# EAGLE design sensors (EAGLE 6.1)
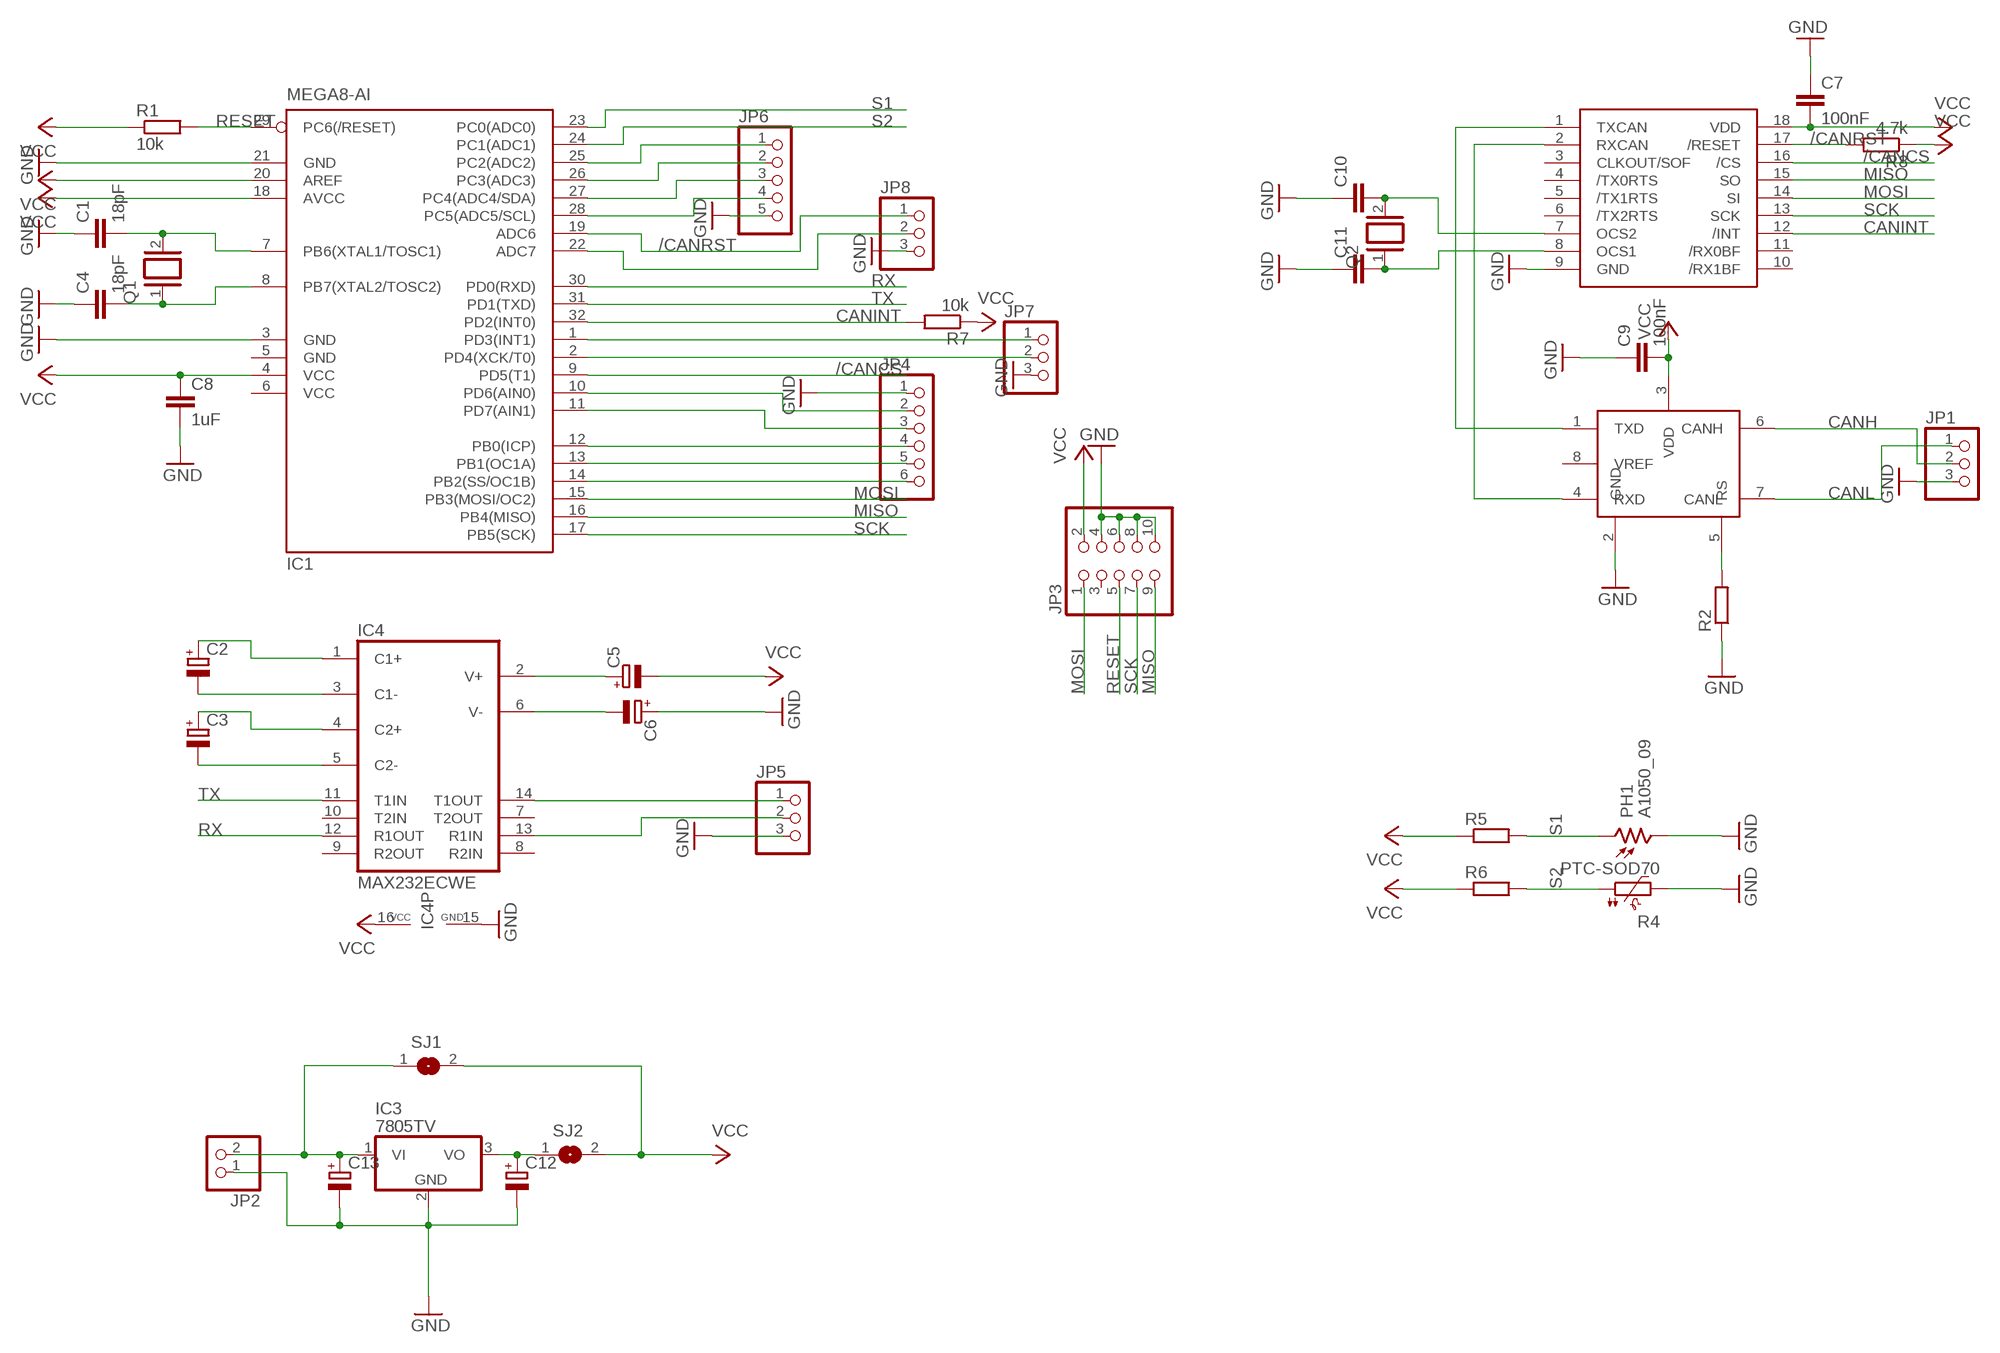
[diagram p0: schematic, sheet 1]

## Parts
C1  18pF  C-EUC0805  [C0805]
C2  CPOL-EUE3.5-8  [E3,5-8]
C3  CPOL-EUE3.5-8  [E3,5-8]
C4  18pF  C-EUC0805  [C0805]
C5  CPOL-EUE3.5-8  [E3,5-8]
C6  CPOL-EUE3.5-8  [E3,5-8]
C7  100nF  C-EUC0603  [C0603]
C8  1uF  C-EUC0603  [C0603]
C9  100nF  C-EUC0603  [C0603]
C10  C-EUC0805  [C0805]
C11  C-EUC0805  [C0805]
C12  CPOL-EU140CLH-0810  [140CLH-0810]
C13  CPOL-EU140CLH-0810  [140CLH-0810]
IC1  MEGA8-AI  [TQFP32-08]
IC3  7805TV  [TO220V]
IC4  MAX232ECWE  [SO16L]
JP1  PINHD-1X3  [1X03]
JP2  PINHD-1X2  [1X02]
JP3  PINHD-2X5  [2X05]
JP4  PINHD-1X6  [1X06]
JP5  PINHD-1X3  [1X03]
JP6  PINHD-1X5  [1X05]
JP7  PINHD-1X3  [1X03]
JP8  PINHD-1X3  [1X03]
PH1  A1050_09  [T0-46-A10XX]
Q1  XTAL/S  [QS]
Q2  XTAL/S  [QS]
R1  10k  R-EU_R0805  [R0805]
R2  R-EU_R0805  [R0805]
R4  PTC-SOD70  [SOD70]
R5  R-EU_R0805  [R0805]
R6  R-EU_R0805  [R0805]
R7  10k  R-EU_R0805  [R0805]
R8  4.7k  R-EU_R0805  [R0805]
SJ1  SJ  [SJ]
SJ2  SJ  [SJ]
U$1  MCP251518-LEAD_SOIC  [SOIC18L]
U$2  MCP2551SOIC8  [SOIC8]

## Nets
/CANCS: IC1.9(PD5(T1)) U$1.16(/CS)
/CANRST: IC1.19(ADC6) JP8.1 R8.2 U$1.17(/RESET)
CANH: JP1.2 U$2.6(CANH)
CANINT: IC1.32(PD2(INT0)) R7.2 U$1.12(/INT)
CANL: JP1.1 U$2.7(CANL)
GND: C1.1 C4.1 C6.+ C7.1 C8.2 C9.1 C10.1 C11.1 C12.- C13.- IC1.3(GND) IC1.21(GND) IC3.2(GND) IC4.15(GND) JP1.3 JP2.1 JP3.4 JP3.6 JP3.8 JP3.10 JP4.1 JP5.3 JP6.5 JP7.3 JP8.3 PH1.2 R2.1 R4.2 U$1.9(GND) U$2.2(GND)
MISO: IC1.16(PB4(MISO)) JP3.9 U$1.15(SO)
MOSI: IC1.15(PB3(MOSI/OC2)) JP3.1 U$1.14(SI)
N$1: U$1.1(TXCAN) U$2.1(TXD)
N$2: U$1.2(RXCAN) U$2.4(RXD)
N$3: C3.+ IC4.4(C2+)
N$4: C2.- IC4.3(C1-)
N$5: C2.+ IC4.1(C1+)
N$6: C3.- IC4.5(C2-)
N$7: C1.2 IC1.7(PB6(XTAL1/TOSC1)) Q1.2
N$8: C4.2 IC1.8(PB7(XTAL2/TOSC2)) Q1.1
N$9: R2.2 U$2.5(RS)
N$10: IC4.14(T1OUT) JP5.1
N$11: IC4.13(R1IN) JP5.2
N$12: C5.+ IC4.2(V+)
N$13: C6.- IC4.6(V-)
N$14: IC1.12(PB0(ICP)) JP4.4
N$15: C12.+ IC3.3(VO) SJ2.1
N$16: C13.+ IC3.1(VI) JP2.2 SJ1.1
N$17: IC1.13(PB1(OC1A)) JP4.5
N$18: IC1.14(PB2(SS/OC1B)) JP4.6
N$19: IC1.10(PD6(AIN0)) JP4.2
N$20: IC1.11(PD7(AIN1)) JP4.3
N$22: IC1.28(PC5(ADC5/SCL)) JP6.4
N$23: C10.2 Q2.2 U$1.7(OCS2)
N$24: IC1.27(PC4(ADC4/SDA)) JP6.3
N$25: IC1.26(PC3(ADC3)) JP6.2
N$26: IC1.25(PC2(ADC2)) JP6.1
N$27: IC1.1(PD3(INT1)) JP7.1
N$28: IC1.2(PD4(XCK/T0)) JP7.2
N$30: IC1.22(ADC7) JP8.2
N$31: C11.2 Q2.1 U$1.8(OCS1)
RESET: IC1.29(PC6(/RESET)) JP3.5 R1.2
RX: IC1.30(PD0(RXD)) IC4.12(R1OUT)
S1: IC1.23(PC0(ADC0)) PH1.1 R5.2
S2: IC1.24(PC1(ADC1)) R4.1 R6.2
SCK: IC1.17(PB5(SCK)) JP3.7 U$1.13(SCK)
TX: IC1.31(PD1(TXD)) IC4.11(T1IN)
VCC: C5.- C7.2 C8.1 C9.2 IC1.4(VCC) IC1.18(AVCC) IC1.20(AREF) IC4.16(VCC) JP3.2 R1.1 R5.1 R6.1 R7.1 R8.1 SJ1.2 SJ2.2 U$1.18(VDD) U$2.3(VDD)
Unconnected: IC4.7(T2OUT) IC4.8(R2IN) IC4.9(R2OUT) IC4.10(T2IN) JP3.3 U$1.3(CLKOUT/SOF) U$1.4(/TX0RTS) U$1.5(/TX1RTS) U$1.6(/TX2RTS) U$1.10(/RX1BF) U$1.11(/RX0BF) U$2.8(VREF)

## Power pins joined to a net without a drawn wire
GND: IC1.5(GND)
VCC: IC1.6(VCC)

## Library data of the parts
C1 C4 = resistor:C-EU: CAPACITOR, European symbol
C2 C3 C5 C6 = rcl:CPOL-EU: POLARIZED CAPACITOR, European symbol
C7-C11 = rcl:C-EU: CAPACITOR, European symbol
C12 C13 = resistor:CPOL-EU: POLARIZED CAPACITOR, European symbol
IC1 = atmel:MEGA8: MICROCONTROLLER 8 Kbytes FLASH, 1 kbytes SRAM, 512 bytes EEPROM, USART, 6-channel 10 bit ADC, 2-channel 8 bit ADC Pin compatible with Atmega48, ATMega88, ATMega168 Source: avr.lbr; MPN: ATMEGA8-16AU; OC_FARNELL: 9171371; OC_NEWARK: 73M8863
IC3 = linear:78*: Positive VOLTAGE REGULATOR Source: http://cache.national.com/ds/LM/LM78L05.pdf http://www.fairchildsemi.com/ds/LM/LM7805.pdf
IC4 = maxim:MAX232ECWE: RS232 TRANSEIVER; MF: MAXIM; MPN: MAX232ECWE+; OC_FARNELL: 9724435; OC_NEWARK: 67K4440
JP1 JP5 JP7 JP8 = pinhead:PINHD-1X3: PIN HEADER
JP2 = pinhead:PINHD-1X2: PIN HEADER
JP3 = pinhead:PINHD-2X5: PIN HEADER
JP4 = pinhead:PINHD-1X6: PIN HEADER
JP6 = pinhead:PINHD-1X5: PIN HEADER
PH1 = photo-elements:A10: Sensor Robust Light Sensing Applications Outdoor Light Sensing Application Source: http://optoelectronics.perkinelmer.com/content/Datasheets/DTS_PhotocellsA1050.pdf
Q1 Q2 = special:XTAL/S: CRYSTAL
R1 R2 R7 = resistor:R-EU_: RESISTOR, European symbol
R4 = ptc-ntc:PTC-: Positive Temperature Coefficient Resistor (PTC) termistor Philips KTY81-210 - KTY81-252 Source: 153627-da-01-en-Temperatur-Sensor_KTY10-6_Philips.pdf; OC_FARNELL: unknown; OC_NEWARK: unknown
R5 R6 R8 = rcl:R-EU_: RESISTOR, European symbol
SJ1 SJ2 = jumper:SJ: SMD solder JUMPER
U$1 = glados:MCP2515
U$2 = glados:MCP2551

## Board
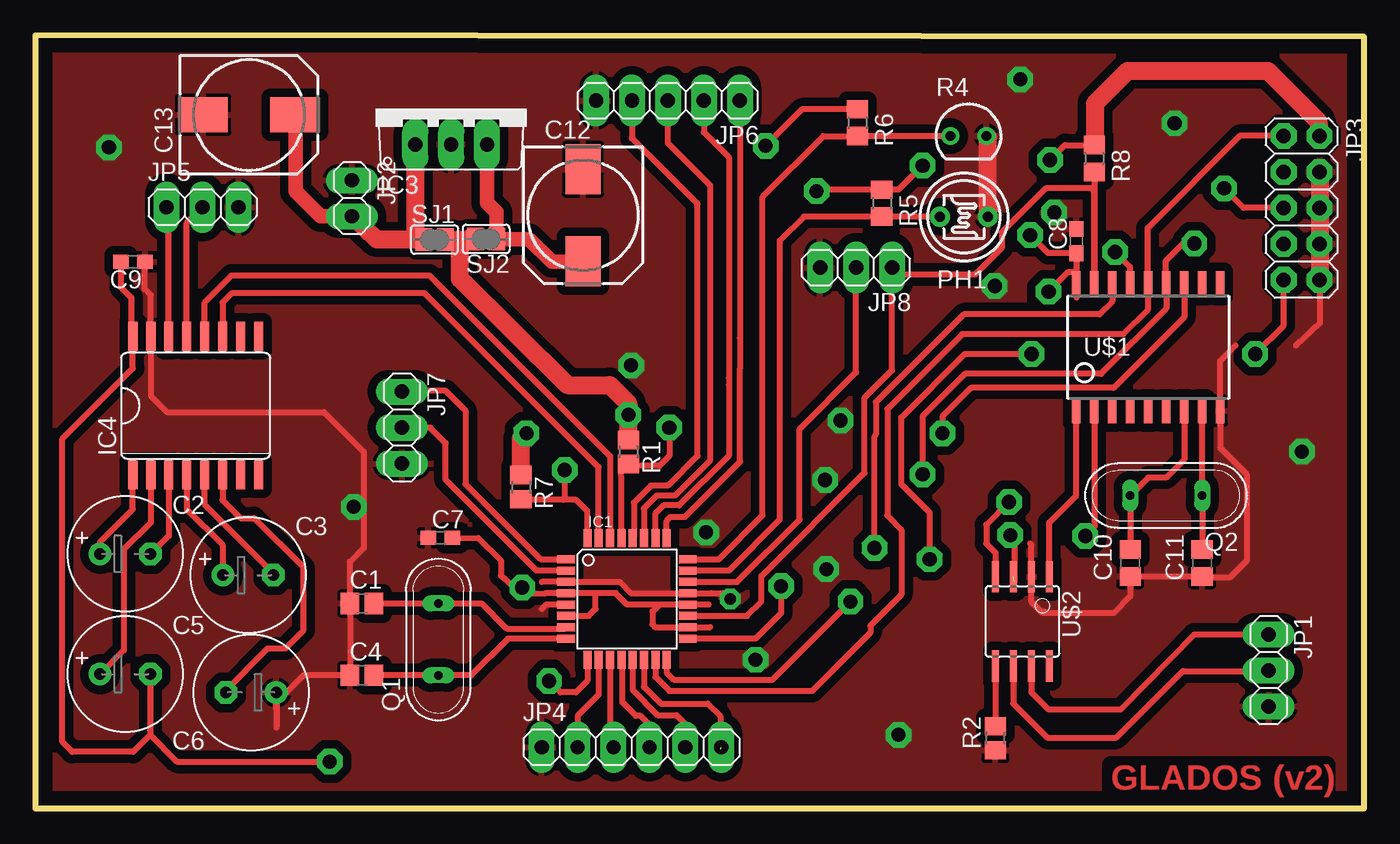
[diagram p1: board, top side]
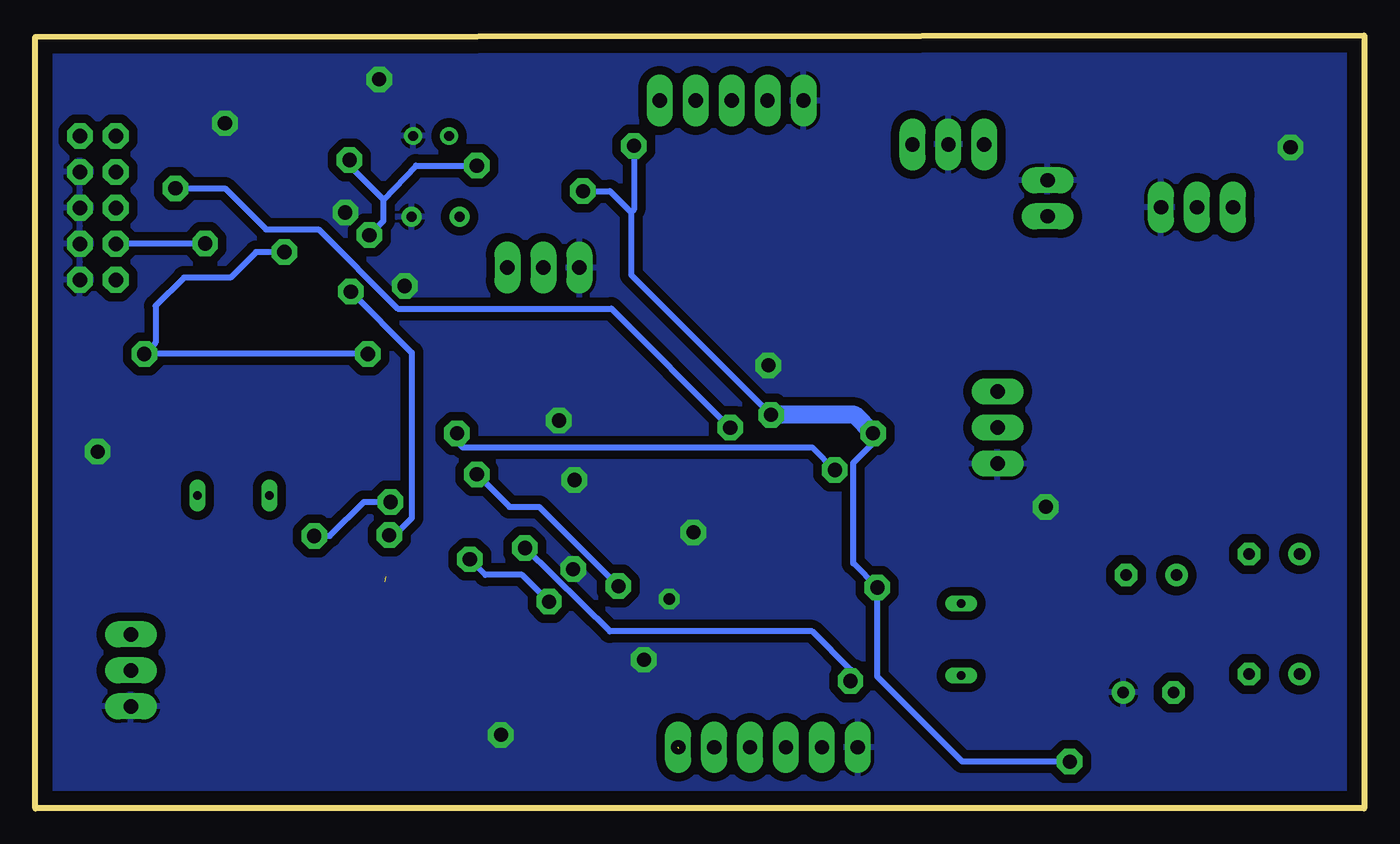
[diagram p2: board, bottom side, seen from below]

Size 93.9 x 54.61 mm. Coordinates in mm from the lower left corner, seen from the top.
Outline: 0,0 93.9,0 93.9,54.51 0,54.61 0,0
Copper layers (1*16): Top 0.035mm / dielectric 1.5mm / Bottom 0.035mm
Design rules: minimum track width 10mil, minimum drill 24mil, track to track 8mil, track to pad 8mil, pad to pad 8mil, via to via 8mil, smd to smd 8mil, copper to edge 40mil, drill to drill 8mil, minimum pad ring 10mil, minimum via ring 8mil, stop-mask expansion 4mil, vias tented up to drill 0mil, thermal gap 10mil

### Footprints (pad centres in the part's own frame; a part is rotated, then mirrored left to right if it is on the bottom)
C0805 = smd 1.3 x 1.5: 1 -0.85,0; 2 0.85,0
E3,5-8 = drill 0.813 pad 1.6: + -1.778,0 | drill 0.813 pad 1.6 octagon: - 1.778,0
C0603 = smd 1.1 x 1: 1 -0.85,0; 2 0.85,0
C0805' = smd 1.3 x 1.5: 1 -0.95,0; 2 0.95,0
140CLH-0810 = smd 3.5 x 2.5: + 3.25,0; - -3.25,0
TQFP32-08 = smd 1.27 x 0.559: 1 -4.293,2.8; 2 -4.293,2; 3 -4.293,1.2; 4 -4.293,0.4; 5 -4.293,-0.4; 6 -4.293,-1.2; 7 -4.293,-2; 8 -4.293,-2.8; 17 4.293,-2.8; 18 4.293,-2; 19 4.293,-1.2; 20 4.293,-0.4; 21 4.293,0.4; 22 4.293,1.2; 23 4.293,2; 24 4.293,2.8 | smd 0.559 x 1.27: 9 -2.8,-4.293; 10 -2,-4.293; 11 -1.2,-4.293; 12 -0.4,-4.293; 13 0.4,-4.293; 14 1.2,-4.293; 15 2,-4.293; 16 2.8,-4.293; 25 2.8,4.293; 26 2,4.293; 27 1.2,4.293; 28 0.4,4.293; 29 -0.4,4.293; 30 -1.2,4.293; 31 -2,4.293; 32 -2.8,4.293
TO220V = drill 1.016 long: 1 -2.54,-2.54; 2 0,-2.54; 3 2.54,-2.54
SO16L = smd 0.66 x 2.032: 1 -4.445,-4.902; 2 -3.175,-4.902; 3 -1.905,-4.902; 4 -0.635,-4.902; 5 0.635,-4.902; 6 1.905,-4.902; 7 3.175,-4.902; 8 4.445,-4.902; 9 4.445,4.902; 10 3.175,4.902; 11 1.905,4.902; 12 0.635,4.902; 13 -0.635,4.902; 14 -1.905,4.902; 15 -3.175,4.902; 16 -4.445,4.902
1X03 = drill 1.016 long: 1 -2.54,0; 2 0,0; 3 2.54,0
1X02 = drill 1.016 long: 1 -1.27,0; 2 1.27,0
2X05 = drill 1.016 octagon: 1 -5.08,-1.27; 2 -5.08,1.27; 3 -2.54,-1.27; 4 -2.54,1.27; 5 0,-1.27; 6 0,1.27; 7 2.54,-1.27; 8 2.54,1.27; 9 5.08,-1.27; 10 5.08,1.27
1X06 = drill 1.016 long: 1 -6.35,0; 2 -3.81,0; 3 -1.27,0; 4 1.27,0; 5 3.81,0; 6 6.35,0
1X05 = drill 1.016 long: 1 -5.08,0; 2 -2.54,0; 3 0,0; 4 2.54,0; 5 5.08,0
T0-46-A10XX = drill 0.7 pad 1.4: 1 -1.7,0; 2 1.7,0
QS = drill 0.61 long: 1 -2.54,0; 2 2.54,0
R0805 = smd 1.3 x 1.5: 1 -0.85,0; 2 0.85,0
SOD70 = drill 0.7 pad 1.27: 1 -1.27,0; 2 1.27,0
R0805' = smd 1.3 x 1.5: 1 -0.95,0; 2 0.95,0
SJ = smd 1.168 x 1.6: 1 -0.762,0; 2 0.762,0
SOIC18L = smd 0.6 x 1.8: 1 -5.08,-4.475; 2 -3.81,-4.475; 3 -2.54,-4.475; 4 -1.27,-4.475; 5 0,-4.475; 6 1.27,-4.475; 7 2.54,-4.475; 8 3.81,-4.475; 9 5.08,-4.475; 10 5.08,4.475; 11 3.81,4.475; 12 2.54,4.475; 13 1.27,4.475; 14 0,4.475; 15 -1.27,4.475; 16 -2.54,4.475; 17 -3.81,4.475; 18 -5.08,4.475
SOIC8 = smd 0.5 x 2.2: 1 -1.905,-3.154; 2 -0.645,-3.154; 3 0.625,-3.154; 4 1.895,-3.154; 5 1.905,3.154; 6 0.635,3.154; 7 -0.635,3.154; 8 -1.905,3.154

### Placement (x,y rotation side)
C1  23.08,14.48 0 top
C2  6.35,17.98 0 top
C3  15.04,16.48 0 top
C4  23.08,9.4 0 top
C5  6.35,9.49 0 top
C6  15.24,8.19 180 top
C7  28.62,19.12 0 top
C8  73.56,40.07 90 top
C9  6.9,38.61 180 top
C10  [C0805']  77.37,17.34 90 top
C11  [C0805']  82.45,17.34 90 top
C12  38.7,41.9 270 top
C13  15.1,49 0 top
IC1  41.81,14.8 0 top
IC3  29.38,49.44 0 top
IC4  11.33,28.45 0 top
JP1  87.15,9.75 270 top
JP2  22.37,43.1 270 top
JP3  89.48,42.42 270 top
JP4  42.13,4.32 0 top
JP5  11.81,42.47 0 top
JP6  44.7,50 180 top
JP7  25.9,26.9 270 top
JP8  58,38.2 180 top
PH1  65.62,41.79 0 top
Q1  28.47,11.94 90 top
Q2  79.91,22.1 180 top
R1  41.91,25.19 270 top
R2  67.84,4.96 90 top
R4  65.94,47.5 0 top
R5  [R0805']  59.81,42.76 270 top
R6  [R0805']  58.1,48.44 270 top
R7  34.31,22.69 270 top
R8  4.7k  [R0805']  74.83,45.91 270 top
SJ1  28.21,40.18 0 top
SJ2  31.84,40.22 180 top
U$1  78.64,32.58 0 top
U$2  69.75,13.21 180 top

### Tracks (layer width: path | path; a pad name or v marks a point on that pad's centre or on a via)
/CANCS  (via drill 1)
  Top 0.406: U$1.16 76.1,35.8 75.2,34.9 65.6,34.9 59.4,28.7 59.4,26.4 59.3,26.3 v59.3,18.4 | IC1.9 39.01,9.01 38.2,8.2 37.1,8.2 v36.3,9
  Bottom 0.406: v36.3,9 36.3,9.8 39,12.5 53.3,12.5 v59.3,18.4
/CANRST
  Top 0.406: R8.2 U$1.17 74.83,43.17 74.8,43.8 71.4,43.8 68.3,40.7 68.3,39.6 66.4,37.7 61.04,37.7 JP8.1 60.54,30.94 58.6,29 58.6,23.7 51.3,16.4 51.3,14.6 50.3,13.6 IC1.19
CANH
  Top 0.406: U$2.6 69.1,7.4 71.5,5 76.4,5 81.1,9.7 87.2,9.7 87.3,9.8 87.2,9.8 JP1.2
CANINT  (via drill 1)
  Top 0.406: U$1.12 81.18,34.68 76.2,29.7 66.1,29.7 64.1,27.7 v64.1,26.5 | IC1.32 39.01,20.99 38.2,21.8 37.3,21.8 | 37.3,21.8 34.38,21.8 R7.2 | v37.4,23.9 37.4,21.9 37.3,21.8
  Bottom 0.406: v64.1,26.5 64.1,25.9 63.7,25.5 39,25.5 v37.4,23.9
CANL
  Top 0.406: U$2.7 70.39,8.21 71.6,7 76.7,7 81.9,12.3 JP1.1
GND  (via drill 0.8, 1)
  Top 0.406: C6.+ 17.04,5.72 17.04,7.5 18.95,9.4 C4.1 C1.1 22.23,17.43 23.2,18.4 23.2,25.2 20.4,28 9.3,28 8.16,29.14 IC4.15 8.16,36.26 7.71,36.7 7.71,38.58 C9.1 | 67.86,42.32 PH1.2 | 84.8,32.7 83.72,31.62 U$1.9 83.72,25.48 85.6,23.6 85.6,17.5 84.4,16.3 82.54,16.3 C11.1 C10.1 77.37,14.97 76.2,13.8 71.2,13.8 | 89.1,32.7 90.8,34.3 90.8,37.29 JP3.10 | 70.3,18.7 70.4,18.61 U$2.2 70.4,14.6 71.2,13.8 | 71.2,13.8 71.3,13.9 | IC1.5 36.1,14.4 35.8,14.1 | 35.8,16 IC1.3 41.3,16 42.1,15.2 IC1.21 47.3,15.2 47.8,15.2 48.6,15.2 49,14.8
  Top 1.27: JP3.4 JP3.6 JP3.8 JP3.10 | PH1.2 67.32,47.39 R4.2
  other vias: 80.5,48.4 55.8,23.2 47.4,19.5 55.9,16.9 56.9,27.4 42.1,31.3 50.9,10.5 22.5,21.3 5.2,46.7 61,5.2 89.5,25.2 69.6,51.5 67.8,36.9 72,42.1 49.1,14.8
  pour Bottom (isolate 0.61): -0.5,58.3 167.1,58 167.3,-8.9 -40.8,-8.7 -41,58.8
  pour Top (isolate 0.61): -0.4,90 106.6,90.9 105,-39.4 -3,-39.4 -2.4,84.4
MISO  (via drill 1)
  Top 0.406: IC1.16 44.61,9.59 45.1,9.1 52.1,9.1 v57.6,14.6 | v63.2,17.6 63.2,20.9 61.2,22.9 61.2,27.6 65.7,32.1 v70.4,32.1 | v86.2,32.1 88.21,34.11 JP3.9 | U$1.15 77.37,38.23 v76.3,39.3
  Bottom 0.406: v57.6,14.6 59.5,16.5 62.1,16.5 v63.2,17.6 | v70.4,32.1 v86.2,32.1 85.4,32.9 85.4,35.5 83.4,37.5 80.1,37.5 78.3,39.3 v76.3,39.3
MOSI
  Top 0.406: JP3.1 85.1,47.5 78.6,41 78.6,37.09 U$1.14 78.64,35.24 76.9,33.5 65.5,33.5 60.2,28.2 60.2,20.7 61.2,19.7 61.2,15.1 59,12.9 59,12.4 54.9,8.3 44.8,8.3 43.81,9.29 IC1.15
N$1
  Top 0.406: U$2.1 71.66,20.2 73.56,22.1 U$1.1
N$2  (via drill 1)
  Top 0.406: U$1.2 74.83,19.88 v74.2,19.24 | U$2.4 67.84,16.37 67.84,18.05 67.2,18.7 67.2,20.05 v68.8,21.65
  Bottom 0.406: v74.2,19.24 73.09,19.24 70.69,21.65 v68.8,21.65
N$3
  Top 0.406: IC4.4 10.7,21.15 13.24,18.61 13.24,16.41 C3.+
N$4
  Top 0.406: IC4.3 9.43,19.24 8.16,17.97 8.16,17.61 C2.-
N$5
  Top 0.406: C2.+ 4.57,18.83 6.89,21.15 IC4.1
N$6
  Top 0.406: C3.- 16.92,16.51 11.96,21.46 IC4.5
N$7
  Top 0.406: IC1.7 37.42,12.7 33.3,12.7 31.52,14.48 Q1.2 C1.2
N$8
  Top 0.406: IC1.8 33.4,12 30.8,9.4 Q1.1 C4.2
N$9
  Top 0.406: U$2.5 R2.2
N$10
  Top 0.406: IC4.14 9.43,42.32 JP5.1
N$11
  Top 0.406: IC4.13 10.7,41.36 JP5.2
N$12
  Top 0.406: IC4.2 8.16,20.2 6.25,18.29 6.25,11.17 C5.+
N$13
  Top 0.406: C6.- 13.36,8.26 16.41,11.3 17.68,11.3 18.95,12.57 18.95,17.02 15.46,20.51 14.51,20.51 13.24,21.78 IC4.6
N$14
  Top 0.406: JP4.4 43.4,5.91 42.76,6.54 42.45,6.54 41.49,7.5 41.49,10.42 IC1.12
N$15
  Top 1.016: IC3.3 31.92,42.78 32.6,42.1 SJ2.1 34.88,40.22 36.5,38.6 38.15,38.6 C12.+
N$16
  Top 1.016: JP2.2 20.17,41.83 18.4,43.6 18.4,48.95 C13.+
  Top 1.27: IC3.1 26.84,40.19 SJ1.1 24.12,40.18 JP2.2
N$17
  Top 0.406: IC1.13 42.21,8.36 43.98,6.59 45.3,6.59 45.94,5.96 JP4.5
N$18  (1 unrouted)
  Top 0.406: IC1.14 43.01,8.59 44.2,7.4 47.5,7.4 48.4,6.5 48.4,4.2 48.5,4.1
N$19
  Top 0.406: IC1.10 39.81,8.04 38.32,6.54 JP4.2
N$20
  Top 0.406: IC1.11 40.61,4.57 JP4.3
N$22
  Top 0.406: IC1.28 42.3,19.18 42.3,21.6 43.5,22.8 44.7,22.8 46.8,24.9 46.8,42.7 42.16,47.34 JP6.4
N$23
  Top 0.406: C10.2 Q2.2 78.64,23.37 79.91,23.37 81.18,24.64 U$1.7
N$24
  Top 0.406: IC1.27 43,21.2 43.9,22.1 45.2,22.1 47.7,24.6 47.7,44 44.7,47 JP6.3
N$25
  Top 0.406: IC1.26 43.8,20.8 44.4,21.4 45.5,21.4 49,24.9 49,29.9 49,30.4 49,46 47.24,47.76 JP6.2
N$26
  Top 0.406: IC1.25 44.61,20.31 44.9,20.6 45.9,20.6 49.8,24.5 49.8,31.1 49.78,33.22 JP6.1
N$27
  Top 0.406: IC1.1 35.7,17.6 30.4,22.9 30.4,28.1 29,29.5 25.96,29.5 JP7.1
N$28
  Top 0.406: IC1.2 35.4,16.8 29,23.2 29,25.8 27.9,26.9 JP7.2
N$30
  Top 0.406: IC1.22 49.6,16 54,20.4 54,26.8 58,30.8 JP8.2
N$31
  Top 0.406: C11.2 Q2.1 U$1.8
RESET  (via drill 1)
  Top 0.406: IC1.29 41.41,23.01 41.4,24 41.95,24 R1.2 42.08,24.2 44.1,24.2 44.8,24.9 v44.8,26.9 | JP3.5 85.38,42.42 v84,43.8
  Bottom 0.406: v84,43.8 80.5,43.8 77.6,40.9 73.9,40.9 68.3,35.3 53.2,35.3 v44.8,26.9
RX
  Top 0.406: IC4.12 11.96,35.75 13.87,37.66 27.84,37.66 40.61,24.89 IC1.30
S1
  Top 0.406: PH1.1 63.9,41.8 R5.2 54.3,41.8 52.6,40.1 52.6,20.4 49,16.8 IC1.23
S2
  Top 0.406: IC1.24 48.3,17.6 51.4,20.7 51.4,43.2 55.69,47.49 R6.2 58.11,47.5 R4.1
SCK  (via drill 1)
  Top 0.406: v81.9,39.9 81.1,39.9 79.9,38.7 79.9,37.06 U$1.13 79.91,35.31 75.3,30.7 65.7,30.7 62.7,27.7 v62.7,23.6 | v52.7,15.7 52.7,13.8 50.9,12 IC1.17
  Bottom 0.406: v81.9,39.9 81.92,39.88 JP3.7 | v62.7,23.6 60.4,21.3 58.3,21.3 v52.7,15.7
TX
  Top 0.406: IC1.31 39.81,24.1 27.52,36.39 13.87,36.39 13.24,35.75 IC4.11
VCC  (via drill 1)  (1 unrouted)
  Top 0.254: SJ2.2 30.88,40.22 30.85,40.25
  Top 0.406: C9.2 6.04,36.8 6.78,36.08 6.78,33.46 IC4.16 6.89,31.08 1.9,26.1 1.9,4.7 2.6,4 6.9,4 8.1,5.2 | 39.6,15.2 IC1.4 36,15.2 34.32,15.18 34.34,15.2 v34.4,15.6 34.2,15.2 33.2,16.2 32.9,16.45 32.9,17.5 31.3,19.1 C7.2 | IC1.6 39.1,13.6 39.6,14.1 39.6,15.2 | 47.7,12.8 IC1.18 43.8,12.8 43.6,13 43.6,13.9 44.1,14.4 IC1.20 | 39.6,15.2 41,15.2 41.8,14.4 IC1.20 | 47.6,14.4 IC1.20 | U$1.18 73.6,37.01 73.6,36.1 | v68.9,19.3 69.2,19 69.2,16 | v55.2,43.6 55.3,43.71 R5.1 61,43.71 v62.7,45.4 | R6.1 54.19,49.39 v51.6,46.8 | v71.7,45.8 72.76,46.86 R8.1 | C5.- 8.1,5.52 8.1,5.2 | 8.1,5.2 10,3.3 v20.8,3.3 | v71.6,36.5 73,37.9 73.4,37.9 73.6,37.7 73.6,37.09 U$1.18 | U$1.18 C8.1 71.58,39.22 v70.3,40.5
  Top 1.016: SJ1.2 29.9,40.18 30.78,40.18 30.85,40.25 31,40.4 30.7,40.4
  Top 1.27: R1.1 v41.91,27.8 41.9,27.81 41.9,28.6 40.6,29.9 37.6,29.9 30,37.4 30,40.08 29.9,40.18 | R7.1 34.31,26.11 v34.7,26.5 | R8.1 74.9,46.93 74.9,49.8 77.2,52.1 87.1,52.1 90.65,48.55 JP3.2
  Bottom 0.406: v71.6,36.5 67.3,32.2 67.3,20.5 68.5,19.3 v68.9,19.3 | v55.2,43.6 53.3,43.6 51.8,42.1 | v51.6,46.8 51.6,42.3 51.8,42.1 | v70.3,40.5 69.3,41.5 69.3,43 | 69.3,43 67,45.4 v62.7,45.4 | 69.3,43 71.7,45.4 v71.7,45.8 | v34.7,26.5 34.7,25.8 36.1,24.4 36.1,17.3 v34.4,15.6 34.4,9.3 28.4,3.3 v20.8,3.3 | 51.8,42.1 51.8,37.69 v41.91,27.8
  Bottom 1.27: v34.7,26.5 36,27.8 v41.91,27.8

### Text on the board
Top: GLADOS (v2)